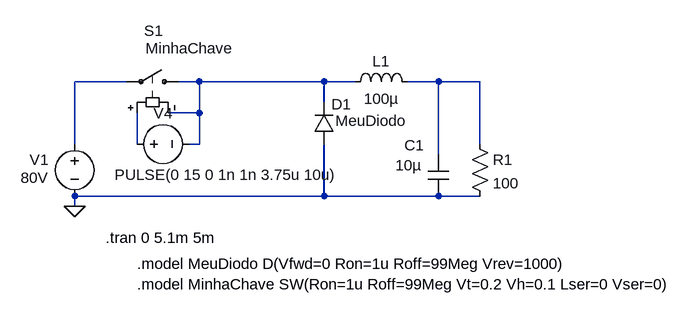
[diagram p0: schematic Conv-A10-PotenciasBuck(LTspice).asc]
Conv-A10-PotenciasBuck(LTspice).asc, the LTspice schematic file:
Version 4
SHEET 1 960 1016
WIRE 48 688 -32 688
WIRE 160 688 128 688
WIRE 352 688 160 688
WIRE 400 688 352 688
WIRE 528 688 480 688
WIRE 592 688 528 688
WIRE 352 720 352 688
WIRE 160 736 160 688
WIRE 160 736 112 736
WIRE -32 784 -32 688
WIRE 64 784 64 736
WIRE 160 784 160 736
WIRE 160 784 144 784
WIRE 592 784 592 688
WIRE 528 800 528 688
WIRE 352 864 352 784
WIRE 352 864 -32 864
WIRE 528 864 352 864
WIRE 592 864 528 864
WIRE -32 880 -32 864
FLAG -32 880 0
SYMBOL voltage -32 768 R0
WINDOW 3 -83 68 Left 2
WINDOW 0 -69 40 Left 2
WINDOW 123 0 0 Left 0
WINDOW 39 0 0 Left 0
SYMATTR Value 80V
SYMATTR InstName V1
SYMBOL voltage 48 784 R270
WINDOW 0 32 56 VTop 2
WINDOW 3 -32 154 VBottom 2
WINDOW 123 0 0 Left 2
WINDOW 39 0 0 Left 2
SYMATTR InstName V4
SYMATTR Value PULSE(0 15 0 1n 1n 3.75u 10u)
SYMBOL ind 384 704 R270
WINDOW 0 32 56 VTop 2
WINDOW 3 5 56 VBottom 2
SYMATTR InstName L1
SYMATTR Value 100µ
SYMBOL cap 512 800 R0
WINDOW 0 -36 -14 Left 2
WINDOW 3 -50 17 Left 2
SYMATTR InstName C1
SYMATTR Value 10µ
SYMBOL res 576 768 R0
SYMATTR InstName R1
SYMATTR Value 100
SYMBOL diode 368 784 R180
WINDOW 0 -26 61 Left 2
WINDOW 3 -112 36 Left 2
SYMATTR InstName D1
SYMATTR Value MeuDiodo
SYMBOL sw 144 688 M270
WINDOW 0 78 69 VLeft 2
WINDOW 3 51 67 VLeft 2
SYMATTR InstName S1
SYMATTR Value MinhaChave
TEXT 64 968 Left 2 !.model MeuDiodo D(Vfwd=0 Ron=1u Roff=99Meg Vrev=1000)
TEXT 64 1000 Left 2 !.model MinhaChave SW(Ron=1u Roff=99Meg Vt=0.2 Vh=0.1 Lser=0 Vser=0)
TEXT 16 928 Left 2 !.tran 0 5.1m 5m

The netlist it stands for:
* Conv-A10-PotenciasBuck(LTspice).asc
V1 N001 0 80V
V4 N004 N002 PULSE(0 15 0 1n 1n 3.75u 10u)
L1 N002 N003 100µ
C1 N003 0 10µ
R1 N003 0 100
D1 0 N002 MeuDiodo
S1 N002 N001 N004 N002 MinhaChave
.model D D
.lib standard.dio
.model MeuDiodo D(Vfwd=0 Ron=1u Roff=99Meg Vrev=1000)
.model MinhaChave SW(Ron=1u Roff=99Meg Vt=0.2 Vh=0.1 Lser=0 Vser=0)
.tran 0 5.1m 5m
.backanno
.end